# Altium schematic sheet JH_Con_board2.SchDoc
size A4; SheetNumber: 2; SheetTotal: 3
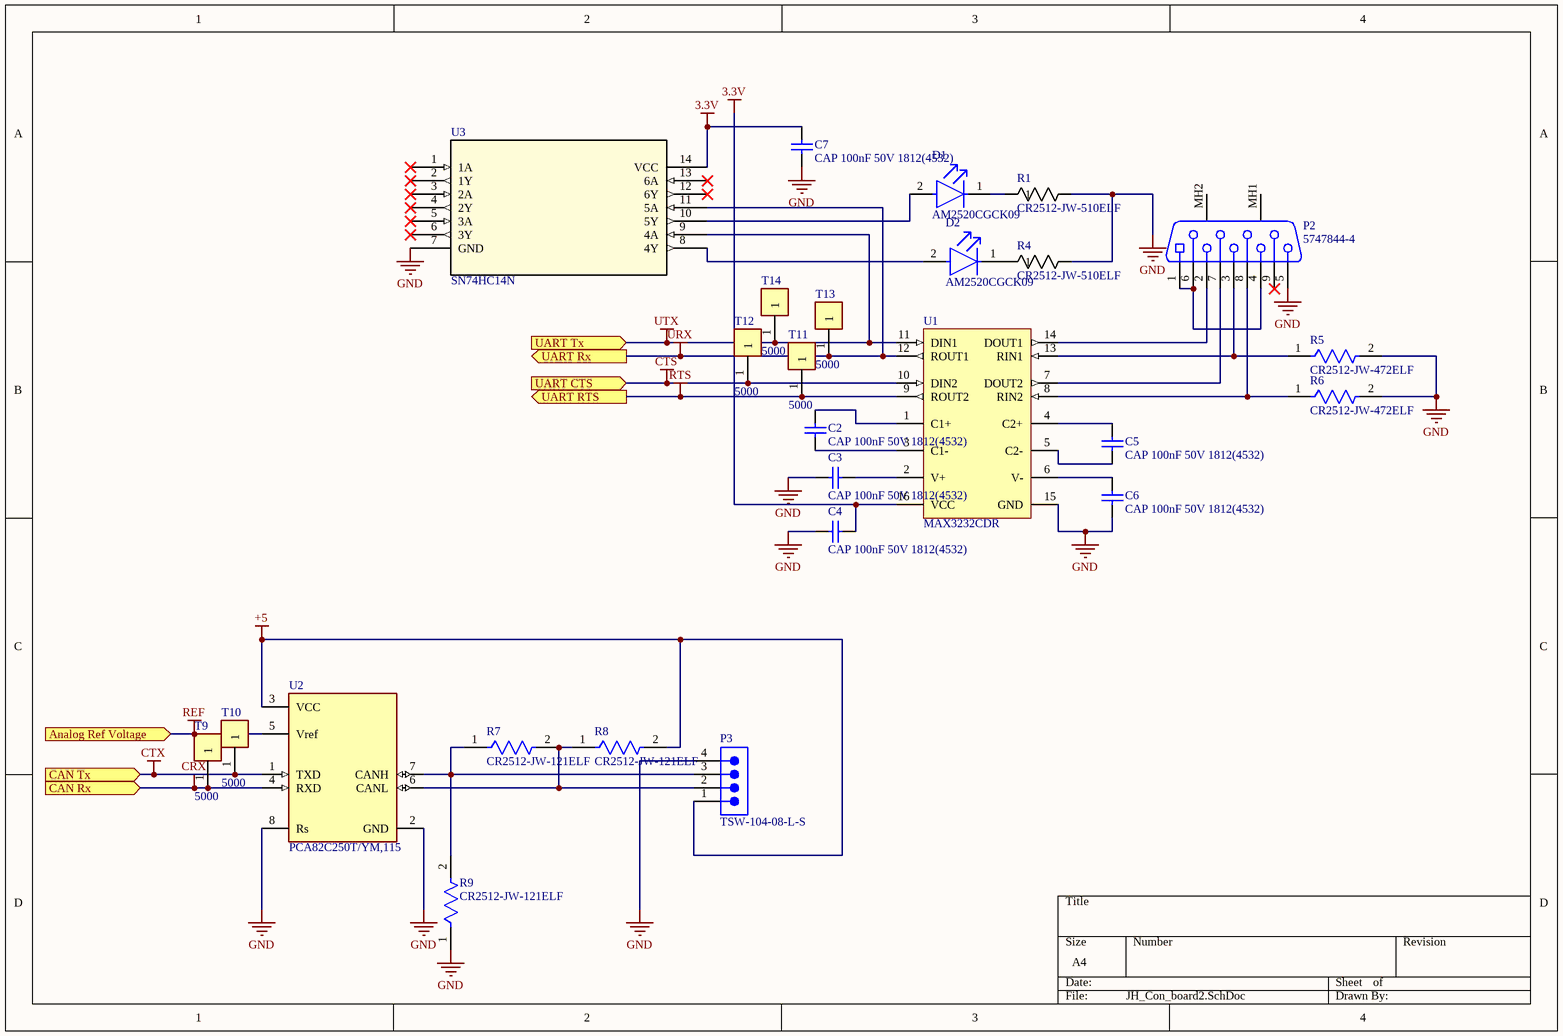
[diagram p0: JH_Con_board2.SchDoc]

## Parts
C2  CAP 100nF 50V 1812(4532)  [CAPC1812(4532)100_M]
C3  CAP 100nF 50V 1812(4532)  [CAPC1812(4532)100_M]
C4  CAP 100nF 50V 1812(4532)  [CAPC1812(4532)100_M]
C5  CAP 100nF 50V 1812(4532)  [CAPC1812(4532)100_M]
C6  CAP 100nF 50V 1812(4532)  [CAPC1812(4532)100_M]
C7  CAP 100nF 50V 1812(4532)  [CAPC1812(4532)100_M]
D1  AM2520CGCK09  [FP-AM2520CGCK09-MFG]
D2  AM2520CGCK09  [FP-AM2520CGCK09-MFG]
P2  5747844-4  [TE-5747844-4_V]
P3  TSW-104-08-L-S  [SMTC-TSW-104-08-X-S]
R1  CR2512-JW-510ELF  [RES_CR2512_BRN]
R4  CR2512-JW-510ELF  [RES_CR2512_BRN]
R5  CR2512-JW-472ELF  [FP-CR2512-IPC_A]
R6  CR2512-JW-472ELF  [FP-CR2512-IPC_A]
R7  CR2512-JW-121ELF  [FP-CR2512-IPC_C]
R8  CR2512-JW-121ELF  [FP-CR2512-IPC_C]
R9  CR2512-JW-121ELF  [FP-CR2512-IPC_C]
T9  5000  [FP-5000-MFG]
T10  5000  [FP-5000-MFG]
T11  5000  [FP-5000-MFG]
T12  5000  [FP-5000-MFG]
T13  5000  [FP-5000-MFG]
T14  5000  [FP-5000-MFG]
U1  MAX3232CDR  [D0016A_L]
U2  PCA82C250T/YM,115  [FP-PCA82C250T-YM_115-MFG]
U3  SN74HC14N  [N14]

## Ports
Analog Ref Voltage (in), CAN Rx (in), CAN Tx (in), UART CTS (in), UART RTS (out), UART Rx (out), UART Tx (in)

## Nets
3.3V: C4.2 C7.2 U1.16(VCC) U3.14(VCC)
+5: P3.1 R8.2 U2.3(VCC)
CRX: T9.1 U2.4(RXD) ; port CAN Rx
CTS: T12.1 U1.10(DIN2) ; port UART CTS
CTX: T10.1 U2.1(TXD) ; port CAN Tx
GND: C3.1 C4.1 C6.1 C7.1 P2.5 P3.4 R1.2 R4.2 R5.2 R6.2 R9.1 U1.15(GND) U2.2(GND) U2.8(Rs) U3.7(GND)
REF: U2.5(Vref) ; port Analog Ref Voltage
RTS: T11.1 U1.9(ROUT2) ; port UART RTS
URX: T13.1 U1.12(ROUT1) U3.11(5A) ; port UART Rx
UTX: T14.1 U1.11(DIN1) U3.9(4A) ; port UART Tx
NetC2_1: C2.1 U1.3(C1-)
NetC2_2: C2.2 U1.1(C1+)
NetC3_2: C3.2 U1.2(V+)
NetC5_1: C5.1 U1.5(C2-)
NetC5_2: C5.2 U1.4(C2+)
NetC6_2: C6.2 U1.6(V-)
NetD1_1: D1.1(C) R1.1
NetD1_2: D1.2(A) U3.10(5Y)
NetD2_1: D2.1(C) R4.1
NetD2_2: D2.2(A) U3.8(4Y)
NetP2_1: P2.1 P2.4 P2.6
NetP2_2: P2.2 U1.14(DOUT1)
NetP2_3: P2.3 R5.1 U1.13(RIN1)
NetP2_7: P2.7 U1.7(DOUT2)
NetP2_8: P2.8 R6.1 U1.8(RIN2)
NetP3_2: P3.2 R7.2 R8.1 U2.6(CANL)
NetP3_3: P3.3 R7.1 R9.2 U2.7(CANH)

Not connected (* = marked no-connect by the designer): P2 9* MH1 MH2; U3 1(1A)* 2(1Y)* 3(2A)* 4(2Y)* 5(3A)* 6(3Y)* 12(6Y)* 13(6A)*

## Library data of the parts
C2-C7 = CMP-1040-01293-1: CAP 100nF 50V ±20% 1812 (4532 Metric) Thickness 1mm SMD; Case-Metric: 4532; Tolerance: Â±20%; Case-EIA: 1812; Rated Voltage: 50 V; Value: 100nF; Max Thickness: 1 mm; Technology: SMT
D1 D2 = CMP-44529-000013-1: LED GREEN CLEAR SMD; Manufacturer: Kingbright; Reverse Voltage: 5V; Led Orientation: Top View; Max Junction Temp: +115°C; Power Dissipation: 75mW; Peak Emmision Wavelength: 574nm; Wavelength: 570nm; Forward Voltage: 2.1V; Forward Current: 20mA; Viewing Angle: 20°; Luminous Intensity: 1000mcd; ComponentLink2Description: Datasheet; Mouser Description: Standard LEDs - SMD Green Water Clear 570nm 400mcd; Temperature: -40°C to +85°C; Category: Diode; Device Class L2: LEDs; Digikey Description: LED GREEN CLEAR SMD; Automotive: No; Device Class L3: unset; Colour: Green; Height: 1.7mm; Temperature Range High: +85°C; Package: AM2520CGCK09; Octopart: https://octopart.com/am2520cgck09-kingbright-5355462; Temperature Range Low: -40°C; ComponentLink2URL: http://www.kingbrightusa.com/images/catalog/SPEC/AM2520CGCK09.pdf; Device Class L1: Optoelectronics; Manufacturer Part Number: AM2520CGCK09; Lead Free: Yes; RoHS: TRUE
P2 = CMP-1684-00001-6: Female D-Sub Receptacle, Pitch 1.3716 mm, 9 Position, Height 12.9286 mm, -55 to 105 degC, RoHS, Tray; Manufacturer: TE Connectivity; Voltage Rating: 125 V; Current Rating: 6 A; Rows: 2; Mounting Technology: Through Hole; Height: 12.54 mm; Lead Pitch: 2.74 mm; ComponentLink1Description: Manufacturer URL; DatasheetVersion: Rev. P, 03/2011; ComponentLink2Description: Datasheet; REACH SVHC: No SVHC; Max Operating Temperature: 105 degC; Contact Material: Bronze; Mount: Through Hole; Contact Plating: Gold; Colour: Black; ComponentLink1URL: http://www.te.com/; RoHSCompliant: true; Min Operating Temperature: -55 degC; PackageReference: 5747844-4; Contact Finish: Gold; Packaging: Tray; Pins: 9; Length: 30.81 mm; Package Quantity: 130; PackageDescription: Female D-Sub Receptacle, Pitch 1.3716 mm, 9 Position, Height 12.9286 mm; ComponentLink2URL: http://www.te.com/commerce/DocumentDelivery/DDEController?Action=srchrtrv&DocNm=5747844&DocType=Customer+Drawing&DocLang=English
P3 = CMP-1024-00358-1: 0.025" SQ Post Header, Through-hole, Vertical, -55 to 125 degC, 2.54 mm Pitch, 4-Pin, Male, RoHS; Manufacturer: Samtec; Pitch: 2.54 mm; PartNumber: TSW-104-08-L-S; RoHS: True; Temperature Range: -55 to 125 degC; PackageDescription: .025[0.64] SQ. Post Terminal Strip Assembly; Orientation: Vertical; ComponentLink2URL: http://www.samtec.com/documents/webfiles/pdf/TSW_TH.PDF; ComponentLink1Description: Manufacturer URL; ComponentLink2Description: Datasheet; PackageVersion: DM, 8/1988; ComponentLink3URL: http://www.samtec.com/documents/webfiles/cpdf/TSW-XXX-XX-XXX-X-XX-XXX-MKT.pdf; Mounting Technology: Through-hole; PackageReference: TSW-104-08-X-S; ComponentLink3Description: Package Specification; ComponentLink1URL: http://www.samtec.com; DatasheetVersion: F-214
R1 R4 = CR2512-JW-510ELF: No Description Available; Mfr_Name: Bourns Electronics; Copyright: Copyright (C) 2023 Ultra Librarian. All rights reserved.; Manufacturer_Part_Number: CR2512-JW-510ELF; RefDes: RefDes; Type: DEV
R5 R6 = CMP-1018-00090-2: Thick Film Chip Resistors 2512 4.7kΩ 1W 5% 200ppm/°C; Resistance: 4.7kR; Voltage Rating: 200V; RoHS Compliant: Yes; Max Power Dissipation: 1W; Number of Terminations: 2; Length: 0.248inch; Termination: SMD/SMT; Case/Package: 2512; Max Operating Temperature: 155°C; Series: CR2512; Package Quantity: 4000; Tolerance: 5%; Power Rating: 1W; Case Code (Metric): 6332; Temperature Coefficient: 200ppm/°C; Height: 0.03inch; Case Code (Imperial): 2512; Width: 0.122inch; Packaging: Tape and Reel; Resistor Type: Thick Film; Mount: Surface Mount; Min Operating Temperature: -55°C
R7-R9 = CMP-07231-004395-1: Thick Film Chip Resistors 2512 120Ω 1W 5% 200ppm/°C; Resistance: 120R; Max Power Dissipation: 1W; Height: 0.03inch; Case/Package: 2512; Tolerance: 5%; Max Operating Temperature: 155°C; Depth: 3.1mm; Mount: Surface Mount; Number of Terminations: 2; Packaging: Tape and Reel; Package Quantity: 4000; Min Operating Temperature: -55°C; Temperature Coefficient: 200ppm/°C; Composition: Thick Film; Length: 0.248inch; Power Rating: 1W; Width: 0.122inch; Military Standard: Not
T9-T14 = CMP-19636-000027-1: PC TEST POINT MINIATURE RED; Outside Diameter: 2.54mm; Body Material: Bronze; Number of Contacts: 1; Insulation: Insulated; Inside Diameter: 1.27mm; Hole Diameter: 1.6mm; Plating: Silver; Material: Nylon; Length: 7.62mm; Package Quantity: 100; Number of Ports: 1; Contact Material: Bronze; Orientation: Straight; RoHS Compliant: Yes; Housing Color: Red; Height: 0.3inch; Series: THM; Lead Free: Lead Free; Color: Red; Contact Plating: Tin; Mount: PCB; Packaging: Bulk; REACH SVHC: No SVHC; Flammability Rating: UL94 V-0
U1 = CMP-0299-00399-2: 3-V to 5.5-V Multichannel RS-232 Line Driver / Receiver with ±15-kV ESD Protection, 0 to 70 degC, 16-Pin SOIC (D), Green (RoHS & no Sb/Br); Receivers Per Package: 2; ESD HBM(kV): +/-15; ICC(Max)(mA): 1; Supply Voltage(s)(V): 3.3 or 5.0; Single Supply: TRUE; ComponentLink1URL: www.ti.com; ComponentLink3URL: http://www.ti.com/litv/pdf/mpds178g; PackageReference: D0016A; ComponentLink2Description: Datasheet; ComponentLink2URL: http://www.ti.com/general/docs/lit/getliterature.tsp?genericPartNumber=MAX3232&fileType=pdf; ComponentLink1Description: Manufacturer URL; PackageDescription: 16-Pin Plastic Small Outline Integrated Circuit, 9.9 x 3.9 mm, Pitch 1.27 mm Pitch; PackageVersion: revM, Jun-2011; Drivers Per Package: 2; SubFamily: RS-232; DatasheetVersion: SLLS410I; ComponentLink3Description: Package Specification; RS-232: TRUE
U2 = CMP-10098-000006-1: IC TRANSCEIVER HALF 1/1 8SO; Manufacturer: NXP Semiconductors; Interface: CAN; Min Supply Voltage: 4.5V; Nominal Supply Current: 14-70mA; Max Supply Voltage: 5.5V; Standoff Height: 0.1mm; Max Junction Temp: +150°C; ComponentLink2URL: https://www.nxp.com/docs/en/data-sheet/PCA82C250.pdf; Temperature Range High: +150°C; Mouser Description: CAN Interface IC CAN CONTROLLER INTERFACE; Ipc Land Pattern Name: SOIC127P600X175-8; Device Class L3: unset; Octopart: https://octopart.com/pca82c250t%2Fym%2C115-nxp+semiconductors-18837169; Lead Free: Yes; ComponentLink2Description: Datasheet; Device Class L1: Integrated Circuits (ICs); Ambient Temperature Range High: +125°C; Package: SOIC8; Digikey Description: IC TRANSCEIVER HALF 1/1 8SO; RoHS: TRUE; Automotive: No; Temperature Range Low: -40°C; Manufacturer Part Number: PCA82C250T/YM,115; Device Class L2: Interface ICs; Ambient Temperature Range Low: -40°C; Temperature: -40°C to +150°C; Category: IC; Footprint Url: https://www.nxp.com/docs/en/package-information/SOT96-1.pdf; Height: 1.75mm
U3 = SN74HC14N: No Description Available; Mfr_Name: Texas Instruments; Copyright: Copyright (C) 2023 Ultra Librarian. All rights reserved.; Manufacturer_Part_Number: SN74HC14N; RefDes: RefDes; Type: DEV